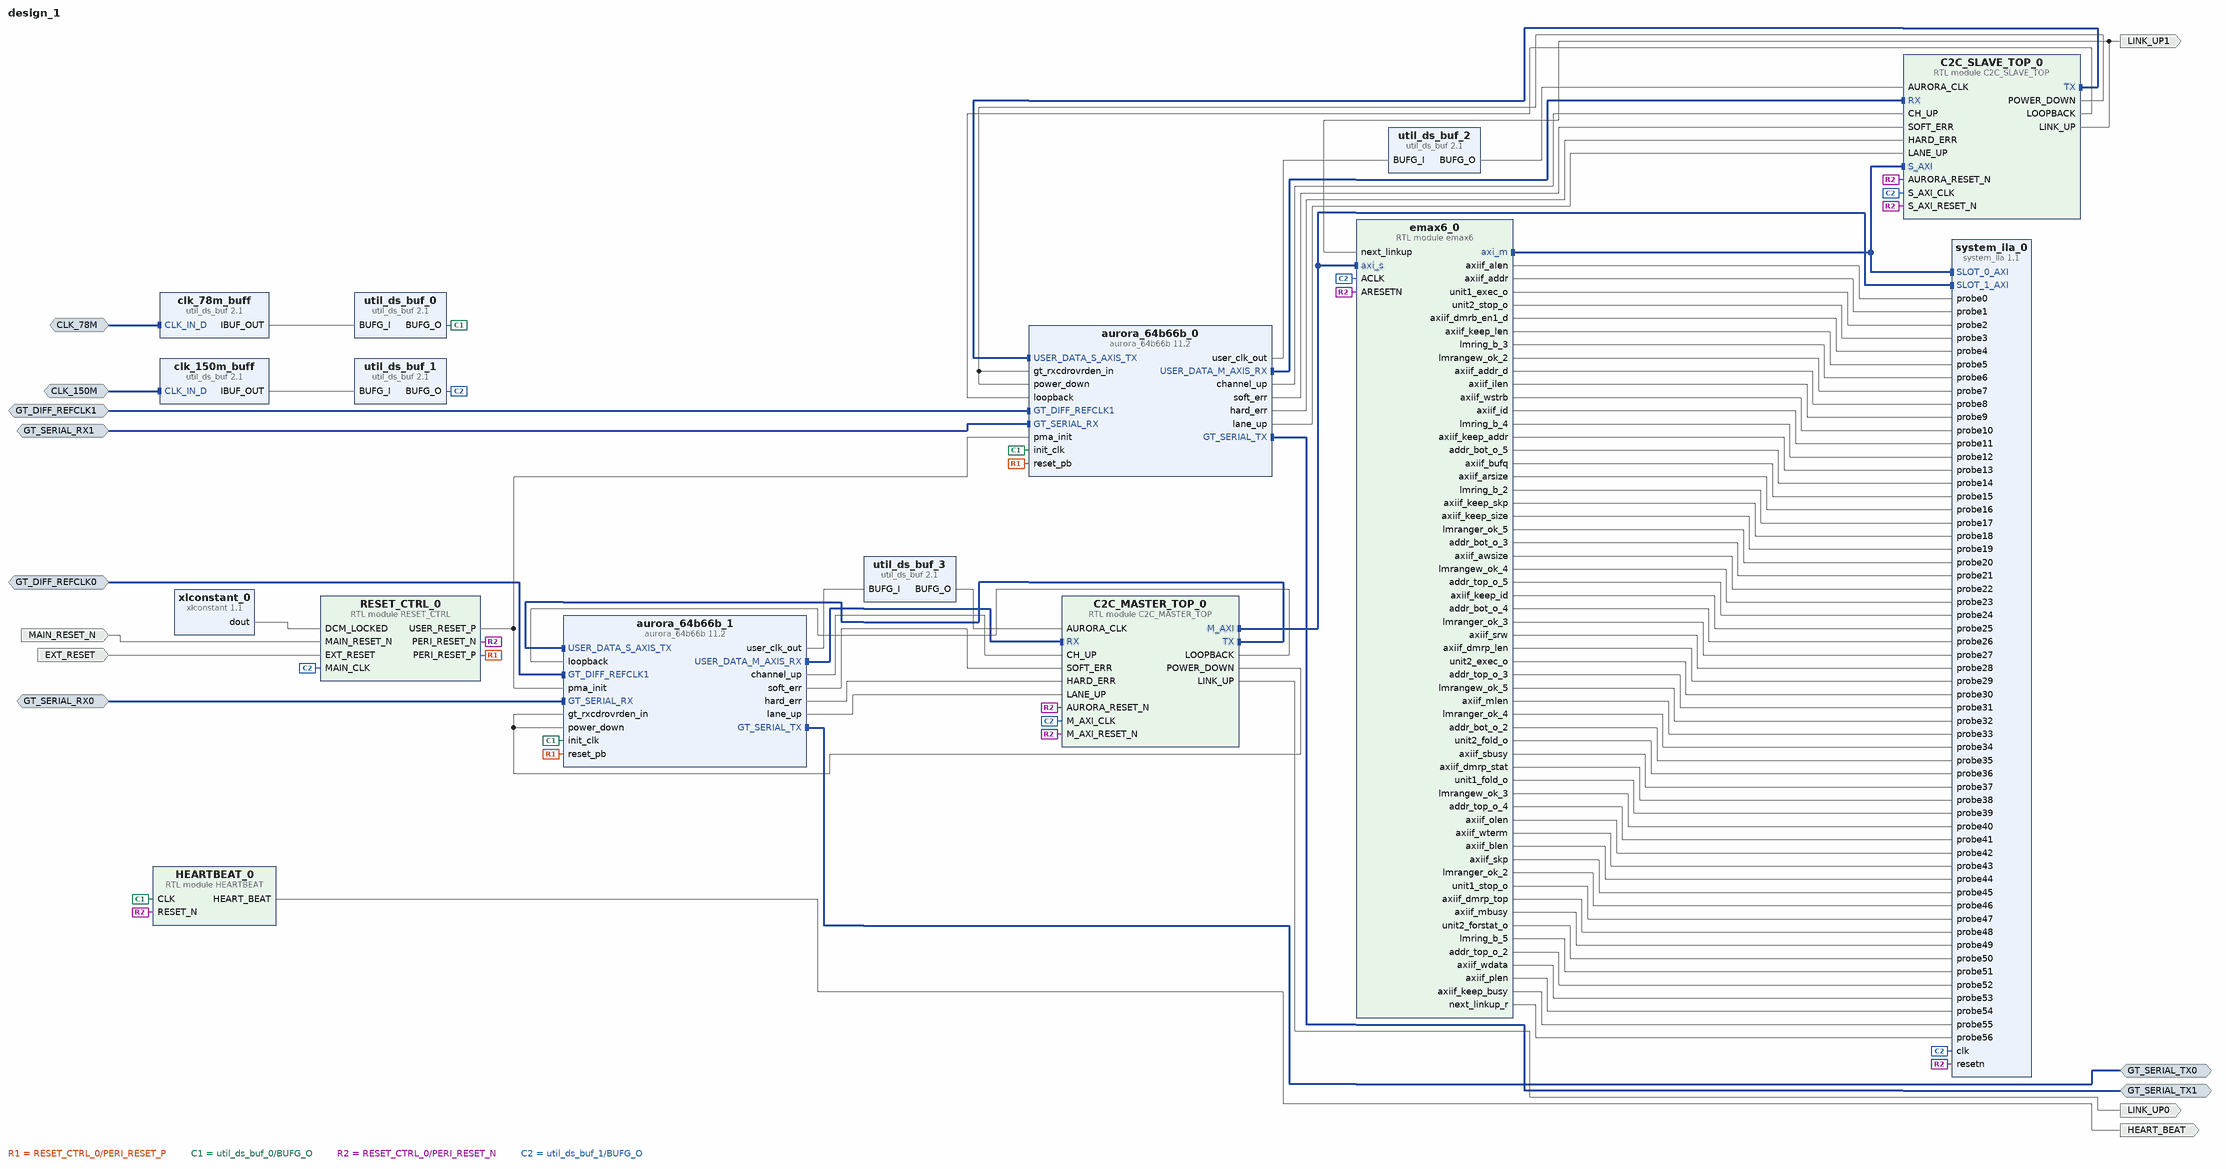
[diagram p0: block diagram of the top level]
# Vivado block design design_1, xcvu440-flga2892-2-e, Vivado 2018.3.1
create_bd_design design_1

create_bd_intf_port -mode Master -vlnv xilinx.com:display_aurora:GT_Serial_Transceiver_Pins_TX_rtl:1.0 GT_SERIAL_TX0
create_bd_intf_port -mode Slave -vlnv xilinx.com:interface:diff_clock_rtl:1.0 GT_DIFF_REFCLK0
set_property -dict {CONFIG.FREQ_HZ 156250000} [get_bd_intf_ports GT_DIFF_REFCLK0]
create_bd_intf_port -mode Slave -vlnv xilinx.com:display_aurora:GT_Serial_Transceiver_Pins_RX_rtl:1.0 GT_SERIAL_RX0
create_bd_intf_port -mode Master -vlnv xilinx.com:display_aurora:GT_Serial_Transceiver_Pins_TX_rtl:1.0 GT_SERIAL_TX1
create_bd_intf_port -mode Slave -vlnv xilinx.com:interface:diff_clock_rtl:1.0 GT_DIFF_REFCLK1
set_property -dict {CONFIG.FREQ_HZ 156250000} [get_bd_intf_ports GT_DIFF_REFCLK1]
create_bd_intf_port -mode Slave -vlnv xilinx.com:display_aurora:GT_Serial_Transceiver_Pins_RX_rtl:1.0 GT_SERIAL_RX1
create_bd_intf_port -mode Slave -vlnv xilinx.com:interface:diff_clock_rtl:1.0 CLK_78M
set_property -dict {CONFIG.FREQ_HZ 78125000} [get_bd_intf_ports CLK_78M]
create_bd_intf_port -mode Slave -vlnv xilinx.com:interface:diff_clock_rtl:1.0 CLK_150M
set_property -dict {CONFIG.FREQ_HZ 150000000} [get_bd_intf_ports CLK_150M]
create_bd_port -dir O LINK_UP0
create_bd_port -dir O LINK_UP1
create_bd_port -dir I MAIN_RESET_N
create_bd_port -dir I -type rst EXT_RESET
set_property -dict {CONFIG.POLARITY ACTIVE_HIGH} [get_bd_ports EXT_RESET]
create_bd_port -dir O HEART_BEAT

create_bd_cell -type ip -vlnv xilinx.com:ip:util_ds_buf:2.1 clk_78m_buff
create_bd_cell -type ip -vlnv xilinx.com:ip:util_ds_buf:2.1 clk_150m_buff
create_bd_cell -type ip -vlnv xilinx.com:ip:util_ds_buf:2.1 util_ds_buf_0
set_property -dict {CONFIG.C_BUF_TYPE BUFG} [get_bd_cells util_ds_buf_0]
create_bd_cell -type ip -vlnv xilinx.com:ip:util_ds_buf:2.1 util_ds_buf_1
set_property -dict {CONFIG.C_BUF_TYPE BUFG} [get_bd_cells util_ds_buf_1]
create_bd_cell -type ip -vlnv xilinx.com:ip:aurora_64b66b:11.2 aurora_64b66b_0
set_property -dict [list \
  CONFIG.CHANNEL_ENABLE {X0Y0 X0Y1 X0Y2 X0Y3 X0Y4 X0Y5 X0Y6 X0Y7} \
  CONFIG.C_AURORA_LANES 8 \
  CONFIG.C_GT_LOC_5 5 \
  CONFIG.C_GT_LOC_6 6 \
  CONFIG.C_GT_LOC_7 7 \
  CONFIG.C_GT_LOC_8 8 \
  CONFIG.C_LINE_RATE 5 \
  CONFIG.C_USE_BYTESWAP true \
  CONFIG.C_active_transceiverquads 2 \
  CONFIG.SupportLevel 1 \
  CONFIG.drp_mode Disabled \
] [get_bd_cells aurora_64b66b_0]
create_bd_cell -type ip -vlnv xilinx.com:ip:aurora_64b66b:11.2 aurora_64b66b_1
set_property -dict [list \
  CONFIG.CHANNEL_ENABLE {X0Y0 X0Y1 X0Y2 X0Y3 X0Y4 X0Y5 X0Y6 X0Y7} \
  CONFIG.C_AURORA_LANES 8 \
  CONFIG.C_GT_LOC_5 5 \
  CONFIG.C_GT_LOC_6 6 \
  CONFIG.C_GT_LOC_7 7 \
  CONFIG.C_GT_LOC_8 8 \
  CONFIG.C_LINE_RATE 5 \
  CONFIG.C_USE_BYTESWAP true \
  CONFIG.C_active_transceiverquads 2 \
  CONFIG.SupportLevel 1 \
  CONFIG.drp_mode Disabled \
] [get_bd_cells aurora_64b66b_1]
create_bd_cell -type ip -vlnv xilinx.com:ip:util_ds_buf:2.1 util_ds_buf_2
set_property -dict {CONFIG.C_BUF_TYPE BUFG} [get_bd_cells util_ds_buf_2]
create_bd_cell -type ip -vlnv xilinx.com:ip:util_ds_buf:2.1 util_ds_buf_3
set_property -dict {CONFIG.C_BUF_TYPE BUFG} [get_bd_cells util_ds_buf_3]
create_bd_cell -type ip -vlnv xilinx.com:ip:xlconstant:1.1 xlconstant_0
create_bd_cell -type module -reference HEARTBEAT HEARTBEAT_0
create_bd_cell -type module -reference RESET_CTRL RESET_CTRL_0
create_bd_cell -type module -reference C2C_MASTER_TOP C2C_MASTER_TOP_0
create_bd_cell -type module -reference C2C_SLAVE_TOP C2C_SLAVE_TOP_0
create_bd_cell -type ip -vlnv xilinx.com:ip:system_ila:1.1 system_ila_0
set_property -dict [list \
  CONFIG.C_DATA_DEPTH 8192 \
  CONFIG.C_MON_TYPE MIX \
  CONFIG.C_NUM_MONITOR_SLOTS 2 \
  CONFIG.C_NUM_OF_PROBES 57 \
  CONFIG.C_PROBE0_TYPE 0 \
  CONFIG.C_PROBE10_TYPE 0 \
  CONFIG.C_PROBE11_TYPE 0 \
  CONFIG.C_PROBE12_TYPE 0 \
  CONFIG.C_PROBE13_TYPE 0 \
  CONFIG.C_PROBE14_TYPE 0 \
  CONFIG.C_PROBE15_TYPE 0 \
  CONFIG.C_PROBE16_TYPE 0 \
  CONFIG.C_PROBE17_TYPE 0 \
  CONFIG.C_PROBE18_TYPE 0 \
  CONFIG.C_PROBE19_TYPE 0 \
  CONFIG.C_PROBE1_TYPE 0 \
  CONFIG.C_PROBE20_TYPE 0 \
  CONFIG.C_PROBE21_TYPE 0 \
  CONFIG.C_PROBE22_TYPE 0 \
  CONFIG.C_PROBE23_TYPE 0 \
  CONFIG.C_PROBE24_TYPE 0 \
  CONFIG.C_PROBE25_TYPE 0 \
  CONFIG.C_PROBE26_TYPE 0 \
  CONFIG.C_PROBE27_TYPE 0 \
  CONFIG.C_PROBE28_TYPE 0 \
  CONFIG.C_PROBE29_TYPE 0 \
  CONFIG.C_PROBE2_TYPE 0 \
  CONFIG.C_PROBE30_TYPE 0 \
  CONFIG.C_PROBE31_TYPE 0 \
  CONFIG.C_PROBE32_TYPE 0 \
  CONFIG.C_PROBE33_TYPE 0 \
  CONFIG.C_PROBE34_TYPE 0 \
  CONFIG.C_PROBE35_TYPE 0 \
  CONFIG.C_PROBE36_TYPE 0 \
  CONFIG.C_PROBE37_TYPE 0 \
  CONFIG.C_PROBE38_TYPE 0 \
  CONFIG.C_PROBE39_TYPE 0 \
  CONFIG.C_PROBE3_TYPE 0 \
  CONFIG.C_PROBE40_TYPE 0 \
  CONFIG.C_PROBE41_TYPE 0 \
  CONFIG.C_PROBE42_TYPE 0 \
  CONFIG.C_PROBE43_TYPE 0 \
  CONFIG.C_PROBE44_TYPE 0 \
  CONFIG.C_PROBE45_TYPE 0 \
  CONFIG.C_PROBE46_TYPE 0 \
  CONFIG.C_PROBE47_TYPE 0 \
  CONFIG.C_PROBE48_TYPE 0 \
  CONFIG.C_PROBE49_TYPE 0 \
  CONFIG.C_PROBE4_TYPE 0 \
  CONFIG.C_PROBE50_TYPE 0 \
  CONFIG.C_PROBE51_TYPE 0 \
  CONFIG.C_PROBE52_TYPE 0 \
  CONFIG.C_PROBE53_TYPE 0 \
  CONFIG.C_PROBE54_TYPE 0 \
  CONFIG.C_PROBE55_TYPE 0 \
  CONFIG.C_PROBE56_TYPE 0 \
  CONFIG.C_PROBE5_TYPE 0 \
  CONFIG.C_PROBE6_TYPE 0 \
  CONFIG.C_PROBE7_TYPE 0 \
  CONFIG.C_PROBE8_TYPE 0 \
  CONFIG.C_PROBE9_TYPE 0 \
  CONFIG.C_SLOT_0_APC_EN 0 \
  CONFIG.C_SLOT_0_AXI_AR_SEL_DATA 1 \
  CONFIG.C_SLOT_0_AXI_AR_SEL_TRIG 1 \
  CONFIG.C_SLOT_0_AXI_AW_SEL_DATA 1 \
  CONFIG.C_SLOT_0_AXI_AW_SEL_TRIG 1 \
  CONFIG.C_SLOT_0_AXI_B_SEL_DATA 1 \
  CONFIG.C_SLOT_0_AXI_B_SEL_TRIG 1 \
  CONFIG.C_SLOT_0_AXI_R_SEL_DATA 1 \
  CONFIG.C_SLOT_0_AXI_R_SEL_TRIG 1 \
  CONFIG.C_SLOT_0_AXI_W_SEL_DATA 1 \
  CONFIG.C_SLOT_0_AXI_W_SEL_TRIG 1 \
  CONFIG.C_SLOT_0_INTF_TYPE xilinx.com:interface:aximm_rtl:1.0 \
  CONFIG.C_SLOT_1_APC_EN 0 \
  CONFIG.C_SLOT_1_AXI_AR_SEL_DATA 1 \
  CONFIG.C_SLOT_1_AXI_AR_SEL_TRIG 1 \
  CONFIG.C_SLOT_1_AXI_AW_SEL_DATA 1 \
  CONFIG.C_SLOT_1_AXI_AW_SEL_TRIG 1 \
  CONFIG.C_SLOT_1_AXI_B_SEL_DATA 1 \
  CONFIG.C_SLOT_1_AXI_B_SEL_TRIG 1 \
  CONFIG.C_SLOT_1_AXI_R_SEL_DATA 1 \
  CONFIG.C_SLOT_1_AXI_R_SEL_TRIG 1 \
  CONFIG.C_SLOT_1_AXI_W_SEL_DATA 1 \
  CONFIG.C_SLOT_1_AXI_W_SEL_TRIG 1 \
  CONFIG.C_SLOT_1_INTF_TYPE xilinx.com:interface:aximm_rtl:1.0 \
] [get_bd_cells system_ila_0]
create_bd_cell -type module -reference emax6 emax6_0

# ---- connections ----

connect_bd_intf_net [get_bd_intf_ports GT_SERIAL_TX1] [get_bd_intf_pins aurora_64b66b_0/GT_SERIAL_TX]
connect_bd_intf_net [get_bd_intf_pins C2C_SLAVE_TOP_0/TX] [get_bd_intf_pins aurora_64b66b_0/USER_DATA_S_AXIS_TX]
connect_bd_intf_net [get_bd_intf_pins aurora_64b66b_0/USER_DATA_M_AXIS_RX] [get_bd_intf_pins C2C_SLAVE_TOP_0/RX]
connect_bd_intf_net [get_bd_intf_ports CLK_150M] [get_bd_intf_pins clk_150m_buff/CLK_IN_D]
connect_bd_intf_net [get_bd_intf_ports GT_SERIAL_TX0] [get_bd_intf_pins aurora_64b66b_1/GT_SERIAL_TX]
connect_bd_intf_net -intf_net GT_DIFF_REFCLK0_1 [get_bd_intf_ports GT_DIFF_REFCLK0] [get_bd_intf_pins aurora_64b66b_1/GT_DIFF_REFCLK1]
connect_bd_intf_net [get_bd_intf_ports CLK_78M] [get_bd_intf_pins clk_78m_buff/CLK_IN_D]
connect_bd_intf_net -intf_net GT_DIFF_REFCLK1_1 [get_bd_intf_ports GT_DIFF_REFCLK1] [get_bd_intf_pins aurora_64b66b_0/GT_DIFF_REFCLK1]
connect_bd_intf_net -intf_net GT_SERIAL_RX1_1 [get_bd_intf_ports GT_SERIAL_RX1] [get_bd_intf_pins aurora_64b66b_0/GT_SERIAL_RX]
connect_bd_intf_net -intf_net C2C_MASTER_TOP_0_M_AXI [get_bd_intf_pins C2C_MASTER_TOP_0/M_AXI] [get_bd_intf_pins emax6_0/axi_s]
connect_bd_intf_net [get_bd_intf_pins C2C_MASTER_TOP_0/M_AXI] [get_bd_intf_pins system_ila_0/SLOT_1_AXI]
connect_bd_intf_net -intf_net emax6_0_axi_m [get_bd_intf_pins emax6_0/axi_m] [get_bd_intf_pins C2C_SLAVE_TOP_0/S_AXI]
connect_bd_intf_net [get_bd_intf_pins emax6_0/axi_m] [get_bd_intf_pins system_ila_0/SLOT_0_AXI]
connect_bd_intf_net [get_bd_intf_pins aurora_64b66b_1/USER_DATA_M_AXIS_RX] [get_bd_intf_pins C2C_MASTER_TOP_0/RX]
connect_bd_intf_net [get_bd_intf_pins C2C_MASTER_TOP_0/TX] [get_bd_intf_pins aurora_64b66b_1/USER_DATA_S_AXIS_TX]
connect_bd_intf_net -intf_net GT_SERIAL_RX0_1 [get_bd_intf_ports GT_SERIAL_RX0] [get_bd_intf_pins aurora_64b66b_1/GT_SERIAL_RX]
connect_bd_net [get_bd_pins clk_78m_buff/IBUF_OUT] [get_bd_pins util_ds_buf_0/BUFG_I]
connect_bd_net [get_bd_pins clk_150m_buff/IBUF_OUT] [get_bd_pins util_ds_buf_1/BUFG_I]
connect_bd_net [get_bd_pins C2C_SLAVE_TOP_0/POWER_DOWN] [get_bd_pins aurora_64b66b_0/gt_rxcdrovrden_in] [get_bd_pins aurora_64b66b_0/power_down]
connect_bd_net [get_bd_pins C2C_SLAVE_TOP_0/LOOPBACK] [get_bd_pins aurora_64b66b_0/loopback]
connect_bd_net [get_bd_pins aurora_64b66b_0/channel_up] [get_bd_pins C2C_SLAVE_TOP_0/CH_UP]
connect_bd_net [get_bd_pins aurora_64b66b_0/soft_err] [get_bd_pins C2C_SLAVE_TOP_0/SOFT_ERR]
connect_bd_net [get_bd_pins aurora_64b66b_0/hard_err] [get_bd_pins C2C_SLAVE_TOP_0/HARD_ERR]
connect_bd_net [get_bd_pins aurora_64b66b_0/lane_up] [get_bd_pins C2C_SLAVE_TOP_0/LANE_UP]
connect_bd_net [get_bd_pins aurora_64b66b_1/channel_up] [get_bd_pins C2C_MASTER_TOP_0/CH_UP]
connect_bd_net [get_bd_pins aurora_64b66b_1/soft_err] [get_bd_pins C2C_MASTER_TOP_0/SOFT_ERR]
connect_bd_net [get_bd_pins aurora_64b66b_1/hard_err] [get_bd_pins C2C_MASTER_TOP_0/HARD_ERR]
connect_bd_net [get_bd_pins aurora_64b66b_1/lane_up] [get_bd_pins C2C_MASTER_TOP_0/LANE_UP]
connect_bd_net [get_bd_pins aurora_64b66b_0/user_clk_out] [get_bd_pins util_ds_buf_2/BUFG_I]
connect_bd_net [get_bd_pins util_ds_buf_2/BUFG_O] [get_bd_pins C2C_SLAVE_TOP_0/AURORA_CLK]
connect_bd_net [get_bd_pins aurora_64b66b_1/user_clk_out] [get_bd_pins util_ds_buf_3/BUFG_I]
connect_bd_net [get_bd_pins util_ds_buf_3/BUFG_O] [get_bd_pins C2C_MASTER_TOP_0/AURORA_CLK]
connect_bd_net [get_bd_pins C2C_MASTER_TOP_0/LOOPBACK] [get_bd_pins aurora_64b66b_1/loopback]
connect_bd_net [get_bd_pins RESET_CTRL_0/USER_RESET_P] [get_bd_pins aurora_64b66b_0/pma_init] [get_bd_pins aurora_64b66b_1/pma_init]
connect_bd_net [get_bd_pins RESET_CTRL_0/PERI_RESET_P] [get_bd_pins aurora_64b66b_1/reset_pb] [get_bd_pins aurora_64b66b_0/reset_pb]
connect_bd_net [get_bd_pins HEARTBEAT_0/HEART_BEAT] [get_bd_ports HEART_BEAT]
connect_bd_net [get_bd_pins util_ds_buf_0/BUFG_O] \
  [get_bd_pins aurora_64b66b_0/init_clk] [get_bd_pins aurora_64b66b_1/init_clk] [get_bd_pins HEARTBEAT_0/CLK]
connect_bd_net [get_bd_pins RESET_CTRL_0/PERI_RESET_N] \
  [get_bd_pins HEARTBEAT_0/RESET_N] [get_bd_pins C2C_MASTER_TOP_0/M_AXI_RESET_N] \
  [get_bd_pins C2C_MASTER_TOP_0/AURORA_RESET_N] [get_bd_pins C2C_SLAVE_TOP_0/S_AXI_RESET_N] \
  [get_bd_pins C2C_SLAVE_TOP_0/AURORA_RESET_N] [get_bd_pins system_ila_0/resetn] [get_bd_pins emax6_0/ARESETN]
connect_bd_net [get_bd_pins xlconstant_0/dout] [get_bd_pins RESET_CTRL_0/DCM_LOCKED]
connect_bd_net [get_bd_ports MAIN_RESET_N] [get_bd_pins RESET_CTRL_0/MAIN_RESET_N]
connect_bd_net [get_bd_ports EXT_RESET] [get_bd_pins RESET_CTRL_0/EXT_RESET]
connect_bd_net [get_bd_pins C2C_MASTER_TOP_0/LINK_UP] [get_bd_ports LINK_UP0]
connect_bd_net [get_bd_pins C2C_SLAVE_TOP_0/LINK_UP] [get_bd_ports LINK_UP1] [get_bd_pins emax6_0/next_linkup]
connect_bd_net [get_bd_pins util_ds_buf_1/BUFG_O] \
  [get_bd_pins RESET_CTRL_0/MAIN_CLK] [get_bd_pins C2C_MASTER_TOP_0/M_AXI_CLK] [get_bd_pins C2C_SLAVE_TOP_0/S_AXI_CLK] \
  [get_bd_pins system_ila_0/clk] [get_bd_pins emax6_0/ACLK]
connect_bd_net [get_bd_pins C2C_MASTER_TOP_0/POWER_DOWN] [get_bd_pins aurora_64b66b_1/gt_rxcdrovrden_in] [get_bd_pins aurora_64b66b_1/power_down]
connect_bd_net -net axiif_alen [get_bd_pins emax6_0/axiif_alen] [get_bd_pins system_ila_0/probe0]
connect_bd_net -net axiif_addr [get_bd_pins emax6_0/axiif_addr] [get_bd_pins system_ila_0/probe1]
connect_bd_net -net unit1_exec_o [get_bd_pins emax6_0/unit1_exec_o] [get_bd_pins system_ila_0/probe2]
connect_bd_net -net unit2_stop_o [get_bd_pins emax6_0/unit2_stop_o] [get_bd_pins system_ila_0/probe3]
connect_bd_net -net axiif_dmrb_en1_d [get_bd_pins emax6_0/axiif_dmrb_en1_d] [get_bd_pins system_ila_0/probe4]
connect_bd_net -net axiif_keep_len [get_bd_pins emax6_0/axiif_keep_len] [get_bd_pins system_ila_0/probe5]
connect_bd_net -net lmring_b_3 [get_bd_pins emax6_0/lmring_b_3] [get_bd_pins system_ila_0/probe6]
connect_bd_net -net lmrangew_ok_2 [get_bd_pins emax6_0/lmrangew_ok_2] [get_bd_pins system_ila_0/probe7]
connect_bd_net -net axiif_addr_d [get_bd_pins emax6_0/axiif_addr_d] [get_bd_pins system_ila_0/probe8]
connect_bd_net -net axiif_ilen [get_bd_pins emax6_0/axiif_ilen] [get_bd_pins system_ila_0/probe9]
connect_bd_net -net axiif_wstrb [get_bd_pins emax6_0/axiif_wstrb] [get_bd_pins system_ila_0/probe10]
connect_bd_net -net axiif_id [get_bd_pins emax6_0/axiif_id] [get_bd_pins system_ila_0/probe11]
connect_bd_net -net lmring_b_4 [get_bd_pins emax6_0/lmring_b_4] [get_bd_pins system_ila_0/probe12]
connect_bd_net -net axiif_keep_addr [get_bd_pins emax6_0/axiif_keep_addr] [get_bd_pins system_ila_0/probe13]
connect_bd_net -net addr_bot_o_5 [get_bd_pins emax6_0/addr_bot_o_5] [get_bd_pins system_ila_0/probe14]
connect_bd_net -net axiif_bufq [get_bd_pins emax6_0/axiif_bufq] [get_bd_pins system_ila_0/probe15]
connect_bd_net -net axiif_arsize [get_bd_pins emax6_0/axiif_arsize] [get_bd_pins system_ila_0/probe16]
connect_bd_net -net lmring_b_2 [get_bd_pins emax6_0/lmring_b_2] [get_bd_pins system_ila_0/probe17]
connect_bd_net -net axiif_keep_skp [get_bd_pins emax6_0/axiif_keep_skp] [get_bd_pins system_ila_0/probe18]
connect_bd_net -net axiif_keep_size [get_bd_pins emax6_0/axiif_keep_size] [get_bd_pins system_ila_0/probe19]
connect_bd_net -net lmranger_ok_5 [get_bd_pins emax6_0/lmranger_ok_5] [get_bd_pins system_ila_0/probe20]
connect_bd_net -net addr_bot_o_3 [get_bd_pins emax6_0/addr_bot_o_3] [get_bd_pins system_ila_0/probe21]
connect_bd_net -net axiif_awsize [get_bd_pins emax6_0/axiif_awsize] [get_bd_pins system_ila_0/probe22]
connect_bd_net -net lmrangew_ok_4 [get_bd_pins emax6_0/lmrangew_ok_4] [get_bd_pins system_ila_0/probe23]
connect_bd_net -net addr_top_o_5 [get_bd_pins emax6_0/addr_top_o_5] [get_bd_pins system_ila_0/probe24]
connect_bd_net -net axiif_keep_id [get_bd_pins emax6_0/axiif_keep_id] [get_bd_pins system_ila_0/probe25]
connect_bd_net -net addr_bot_o_4 [get_bd_pins emax6_0/addr_bot_o_4] [get_bd_pins system_ila_0/probe26]
connect_bd_net -net lmranger_ok_3 [get_bd_pins emax6_0/lmranger_ok_3] [get_bd_pins system_ila_0/probe27]
connect_bd_net -net axiif_srw [get_bd_pins emax6_0/axiif_srw] [get_bd_pins system_ila_0/probe28]
connect_bd_net -net axiif_dmrp_len [get_bd_pins emax6_0/axiif_dmrp_len] [get_bd_pins system_ila_0/probe29]
connect_bd_net -net unit2_exec_o [get_bd_pins emax6_0/unit2_exec_o] [get_bd_pins system_ila_0/probe30]
connect_bd_net -net addr_top_o_3 [get_bd_pins emax6_0/addr_top_o_3] [get_bd_pins system_ila_0/probe31]
connect_bd_net -net lmrangew_ok_5 [get_bd_pins emax6_0/lmrangew_ok_5] [get_bd_pins system_ila_0/probe32]
connect_bd_net -net axiif_mlen [get_bd_pins emax6_0/axiif_mlen] [get_bd_pins system_ila_0/probe33]
connect_bd_net -net lmranger_ok_4 [get_bd_pins emax6_0/lmranger_ok_4] [get_bd_pins system_ila_0/probe34]
connect_bd_net -net addr_bot_o_2 [get_bd_pins emax6_0/addr_bot_o_2] [get_bd_pins system_ila_0/probe35]
connect_bd_net -net unit2_fold_o [get_bd_pins emax6_0/unit2_fold_o] [get_bd_pins system_ila_0/probe36]
connect_bd_net -net axiif_sbusy [get_bd_pins emax6_0/axiif_sbusy] [get_bd_pins system_ila_0/probe37]
connect_bd_net -net axiif_dmrp_stat [get_bd_pins emax6_0/axiif_dmrp_stat] [get_bd_pins system_ila_0/probe38]
connect_bd_net -net unit1_fold_o [get_bd_pins emax6_0/unit1_fold_o] [get_bd_pins system_ila_0/probe39]
connect_bd_net -net lmrangew_ok_3 [get_bd_pins emax6_0/lmrangew_ok_3] [get_bd_pins system_ila_0/probe40]
connect_bd_net -net addr_top_o_4 [get_bd_pins emax6_0/addr_top_o_4] [get_bd_pins system_ila_0/probe41]
connect_bd_net -net axiif_olen [get_bd_pins emax6_0/axiif_olen] [get_bd_pins system_ila_0/probe42]
connect_bd_net -net axiif_wterm [get_bd_pins emax6_0/axiif_wterm] [get_bd_pins system_ila_0/probe43]
connect_bd_net -net axiif_blen [get_bd_pins emax6_0/axiif_blen] [get_bd_pins system_ila_0/probe44]
connect_bd_net -net axiif_skp [get_bd_pins emax6_0/axiif_skp] [get_bd_pins system_ila_0/probe45]
connect_bd_net -net lmranger_ok_2 [get_bd_pins emax6_0/lmranger_ok_2] [get_bd_pins system_ila_0/probe46]
connect_bd_net -net unit1_stop_o [get_bd_pins emax6_0/unit1_stop_o] [get_bd_pins system_ila_0/probe47]
connect_bd_net -net axiif_dmrp_top [get_bd_pins emax6_0/axiif_dmrp_top] [get_bd_pins system_ila_0/probe48]
connect_bd_net -net axiif_mbusy [get_bd_pins emax6_0/axiif_mbusy] [get_bd_pins system_ila_0/probe49]
connect_bd_net -net unit2_forstat_o [get_bd_pins emax6_0/unit2_forstat_o] [get_bd_pins system_ila_0/probe50]
connect_bd_net -net lmring_b_5 [get_bd_pins emax6_0/lmring_b_5] [get_bd_pins system_ila_0/probe51]
connect_bd_net -net addr_top_o_2 [get_bd_pins emax6_0/addr_top_o_2] [get_bd_pins system_ila_0/probe52]
connect_bd_net -net axiif_wdata [get_bd_pins emax6_0/axiif_wdata] [get_bd_pins system_ila_0/probe53]
connect_bd_net -net axiif_plen [get_bd_pins emax6_0/axiif_plen] [get_bd_pins system_ila_0/probe54]
connect_bd_net -net axiif_keep_busy [get_bd_pins emax6_0/axiif_keep_busy] [get_bd_pins system_ila_0/probe55]
connect_bd_net -net next_linkup_r [get_bd_pins emax6_0/next_linkup_r] [get_bd_pins system_ila_0/probe56]
set_property HDL_ATTRIBUTE.DEBUG true [get_bd_intf_nets C2C_MASTER_TOP_0_M_AXI]
set_property HDL_ATTRIBUTE.MARK_DEBUG true [get_bd_intf_nets C2C_MASTER_TOP_0_M_AXI]
set_property HDL_ATTRIBUTE.DEBUG true [get_bd_intf_nets emax6_0_axi_m]
set_property HDL_ATTRIBUTE.MARK_DEBUG true [get_bd_intf_nets emax6_0_axi_m]
set_property HDL_ATTRIBUTE.DEBUG true [get_bd_nets axiif_alen]
set_property HDL_ATTRIBUTE.MARK_DEBUG true [get_bd_nets axiif_alen]
set_property HDL_ATTRIBUTE.DEBUG true [get_bd_nets axiif_addr]
set_property HDL_ATTRIBUTE.MARK_DEBUG true [get_bd_nets axiif_addr]
set_property HDL_ATTRIBUTE.DEBUG true [get_bd_nets unit1_exec_o]
set_property HDL_ATTRIBUTE.MARK_DEBUG true [get_bd_nets unit1_exec_o]
set_property HDL_ATTRIBUTE.DEBUG true [get_bd_nets unit2_stop_o]
set_property HDL_ATTRIBUTE.MARK_DEBUG true [get_bd_nets unit2_stop_o]
set_property HDL_ATTRIBUTE.DEBUG true [get_bd_nets axiif_dmrb_en1_d]
set_property HDL_ATTRIBUTE.MARK_DEBUG true [get_bd_nets axiif_dmrb_en1_d]
set_property HDL_ATTRIBUTE.DEBUG true [get_bd_nets axiif_keep_len]
set_property HDL_ATTRIBUTE.MARK_DEBUG true [get_bd_nets axiif_keep_len]
set_property HDL_ATTRIBUTE.DEBUG true [get_bd_nets lmring_b_3]
set_property HDL_ATTRIBUTE.MARK_DEBUG true [get_bd_nets lmring_b_3]
set_property HDL_ATTRIBUTE.DEBUG true [get_bd_nets lmrangew_ok_2]
set_property HDL_ATTRIBUTE.MARK_DEBUG true [get_bd_nets lmrangew_ok_2]
set_property HDL_ATTRIBUTE.DEBUG true [get_bd_nets axiif_addr_d]
set_property HDL_ATTRIBUTE.MARK_DEBUG true [get_bd_nets axiif_addr_d]
set_property HDL_ATTRIBUTE.DEBUG true [get_bd_nets axiif_ilen]
set_property HDL_ATTRIBUTE.MARK_DEBUG true [get_bd_nets axiif_ilen]
set_property HDL_ATTRIBUTE.DEBUG true [get_bd_nets axiif_wstrb]
set_property HDL_ATTRIBUTE.MARK_DEBUG true [get_bd_nets axiif_wstrb]
set_property HDL_ATTRIBUTE.DEBUG true [get_bd_nets axiif_id]
set_property HDL_ATTRIBUTE.MARK_DEBUG true [get_bd_nets axiif_id]
set_property HDL_ATTRIBUTE.DEBUG true [get_bd_nets lmring_b_4]
set_property HDL_ATTRIBUTE.MARK_DEBUG true [get_bd_nets lmring_b_4]
set_property HDL_ATTRIBUTE.DEBUG true [get_bd_nets axiif_keep_addr]
set_property HDL_ATTRIBUTE.MARK_DEBUG true [get_bd_nets axiif_keep_addr]
set_property HDL_ATTRIBUTE.DEBUG true [get_bd_nets addr_bot_o_5]
set_property HDL_ATTRIBUTE.MARK_DEBUG true [get_bd_nets addr_bot_o_5]
set_property HDL_ATTRIBUTE.DEBUG true [get_bd_nets axiif_bufq]
set_property HDL_ATTRIBUTE.MARK_DEBUG true [get_bd_nets axiif_bufq]
set_property HDL_ATTRIBUTE.DEBUG true [get_bd_nets axiif_arsize]
set_property HDL_ATTRIBUTE.MARK_DEBUG true [get_bd_nets axiif_arsize]
set_property HDL_ATTRIBUTE.DEBUG true [get_bd_nets lmring_b_2]
set_property HDL_ATTRIBUTE.MARK_DEBUG true [get_bd_nets lmring_b_2]
set_property HDL_ATTRIBUTE.DEBUG true [get_bd_nets axiif_keep_skp]
set_property HDL_ATTRIBUTE.MARK_DEBUG true [get_bd_nets axiif_keep_skp]
set_property HDL_ATTRIBUTE.DEBUG true [get_bd_nets axiif_keep_size]
set_property HDL_ATTRIBUTE.MARK_DEBUG true [get_bd_nets axiif_keep_size]
set_property HDL_ATTRIBUTE.DEBUG true [get_bd_nets lmranger_ok_5]
set_property HDL_ATTRIBUTE.MARK_DEBUG true [get_bd_nets lmranger_ok_5]
set_property HDL_ATTRIBUTE.DEBUG true [get_bd_nets addr_bot_o_3]
set_property HDL_ATTRIBUTE.MARK_DEBUG true [get_bd_nets addr_bot_o_3]
set_property HDL_ATTRIBUTE.DEBUG true [get_bd_nets axiif_awsize]
set_property HDL_ATTRIBUTE.MARK_DEBUG true [get_bd_nets axiif_awsize]
set_property HDL_ATTRIBUTE.DEBUG true [get_bd_nets lmrangew_ok_4]
set_property HDL_ATTRIBUTE.MARK_DEBUG true [get_bd_nets lmrangew_ok_4]
set_property HDL_ATTRIBUTE.DEBUG true [get_bd_nets addr_top_o_5]
set_property HDL_ATTRIBUTE.MARK_DEBUG true [get_bd_nets addr_top_o_5]
set_property HDL_ATTRIBUTE.DEBUG true [get_bd_nets axiif_keep_id]
set_property HDL_ATTRIBUTE.MARK_DEBUG true [get_bd_nets axiif_keep_id]
set_property HDL_ATTRIBUTE.DEBUG true [get_bd_nets addr_bot_o_4]
set_property HDL_ATTRIBUTE.MARK_DEBUG true [get_bd_nets addr_bot_o_4]
set_property HDL_ATTRIBUTE.DEBUG true [get_bd_nets lmranger_ok_3]
set_property HDL_ATTRIBUTE.MARK_DEBUG true [get_bd_nets lmranger_ok_3]
set_property HDL_ATTRIBUTE.DEBUG true [get_bd_nets axiif_srw]
set_property HDL_ATTRIBUTE.MARK_DEBUG true [get_bd_nets axiif_srw]
set_property HDL_ATTRIBUTE.DEBUG true [get_bd_nets axiif_dmrp_len]
set_property HDL_ATTRIBUTE.MARK_DEBUG true [get_bd_nets axiif_dmrp_len]
set_property HDL_ATTRIBUTE.DEBUG true [get_bd_nets unit2_exec_o]
set_property HDL_ATTRIBUTE.MARK_DEBUG true [get_bd_nets unit2_exec_o]
set_property HDL_ATTRIBUTE.DEBUG true [get_bd_nets addr_top_o_3]
set_property HDL_ATTRIBUTE.MARK_DEBUG true [get_bd_nets addr_top_o_3]
set_property HDL_ATTRIBUTE.DEBUG true [get_bd_nets lmrangew_ok_5]
set_property HDL_ATTRIBUTE.MARK_DEBUG true [get_bd_nets lmrangew_ok_5]
set_property HDL_ATTRIBUTE.DEBUG true [get_bd_nets axiif_mlen]
set_property HDL_ATTRIBUTE.MARK_DEBUG true [get_bd_nets axiif_mlen]
set_property HDL_ATTRIBUTE.DEBUG true [get_bd_nets lmranger_ok_4]
set_property HDL_ATTRIBUTE.MARK_DEBUG true [get_bd_nets lmranger_ok_4]
set_property HDL_ATTRIBUTE.DEBUG true [get_bd_nets addr_bot_o_2]
set_property HDL_ATTRIBUTE.MARK_DEBUG true [get_bd_nets addr_bot_o_2]
set_property HDL_ATTRIBUTE.DEBUG true [get_bd_nets unit2_fold_o]
set_property HDL_ATTRIBUTE.MARK_DEBUG true [get_bd_nets unit2_fold_o]
set_property HDL_ATTRIBUTE.DEBUG true [get_bd_nets axiif_sbusy]
set_property HDL_ATTRIBUTE.MARK_DEBUG true [get_bd_nets axiif_sbusy]
set_property HDL_ATTRIBUTE.DEBUG true [get_bd_nets axiif_dmrp_stat]
set_property HDL_ATTRIBUTE.MARK_DEBUG true [get_bd_nets axiif_dmrp_stat]
set_property HDL_ATTRIBUTE.DEBUG true [get_bd_nets unit1_fold_o]
set_property HDL_ATTRIBUTE.MARK_DEBUG true [get_bd_nets unit1_fold_o]
set_property HDL_ATTRIBUTE.DEBUG true [get_bd_nets lmrangew_ok_3]
set_property HDL_ATTRIBUTE.MARK_DEBUG true [get_bd_nets lmrangew_ok_3]
set_property HDL_ATTRIBUTE.DEBUG true [get_bd_nets addr_top_o_4]
set_property HDL_ATTRIBUTE.MARK_DEBUG true [get_bd_nets addr_top_o_4]
set_property HDL_ATTRIBUTE.DEBUG true [get_bd_nets axiif_olen]
set_property HDL_ATTRIBUTE.MARK_DEBUG true [get_bd_nets axiif_olen]
set_property HDL_ATTRIBUTE.DEBUG true [get_bd_nets axiif_wterm]
set_property HDL_ATTRIBUTE.MARK_DEBUG true [get_bd_nets axiif_wterm]
set_property HDL_ATTRIBUTE.DEBUG true [get_bd_nets axiif_blen]
set_property HDL_ATTRIBUTE.MARK_DEBUG true [get_bd_nets axiif_blen]
set_property HDL_ATTRIBUTE.DEBUG true [get_bd_nets axiif_skp]
set_property HDL_ATTRIBUTE.MARK_DEBUG true [get_bd_nets axiif_skp]
set_property HDL_ATTRIBUTE.DEBUG true [get_bd_nets lmranger_ok_2]
set_property HDL_ATTRIBUTE.MARK_DEBUG true [get_bd_nets lmranger_ok_2]
set_property HDL_ATTRIBUTE.DEBUG true [get_bd_nets unit1_stop_o]
set_property HDL_ATTRIBUTE.MARK_DEBUG true [get_bd_nets unit1_stop_o]
set_property HDL_ATTRIBUTE.DEBUG true [get_bd_nets axiif_dmrp_top]
set_property HDL_ATTRIBUTE.MARK_DEBUG true [get_bd_nets axiif_dmrp_top]
set_property HDL_ATTRIBUTE.DEBUG true [get_bd_nets axiif_mbusy]
set_property HDL_ATTRIBUTE.MARK_DEBUG true [get_bd_nets axiif_mbusy]
set_property HDL_ATTRIBUTE.DEBUG true [get_bd_nets unit2_forstat_o]
set_property HDL_ATTRIBUTE.MARK_DEBUG true [get_bd_nets unit2_forstat_o]
set_property HDL_ATTRIBUTE.DEBUG true [get_bd_nets lmring_b_5]
set_property HDL_ATTRIBUTE.MARK_DEBUG true [get_bd_nets lmring_b_5]
set_property HDL_ATTRIBUTE.DEBUG true [get_bd_nets addr_top_o_2]
set_property HDL_ATTRIBUTE.MARK_DEBUG true [get_bd_nets addr_top_o_2]
set_property HDL_ATTRIBUTE.DEBUG true [get_bd_nets axiif_wdata]
set_property HDL_ATTRIBUTE.MARK_DEBUG true [get_bd_nets axiif_wdata]
set_property HDL_ATTRIBUTE.DEBUG true [get_bd_nets axiif_plen]
set_property HDL_ATTRIBUTE.MARK_DEBUG true [get_bd_nets axiif_plen]
set_property HDL_ATTRIBUTE.DEBUG true [get_bd_nets axiif_keep_busy]
set_property HDL_ATTRIBUTE.MARK_DEBUG true [get_bd_nets axiif_keep_busy]
set_property HDL_ATTRIBUTE.DEBUG true [get_bd_nets next_linkup_r]
set_property HDL_ATTRIBUTE.MARK_DEBUG true [get_bd_nets next_linkup_r]

# ---- address map ----
assign_bd_address -offset 0x0000000000 -range 1T -target_address_space [get_bd_addr_spaces C2C_MASTER_TOP_0/M_AXI] [get_bd_addr_segs emax6_0/axi_s/reg0]
assign_bd_address -offset 0x0000000000 -range 1T -target_address_space [get_bd_addr_spaces emax6_0/axi_m] [get_bd_addr_segs C2C_SLAVE_TOP_0/S_AXI/reg0]

validate_bd_design
save_bd_design
